# Altium schematic sheet Sallen_key_LPF.SchDoc
size A
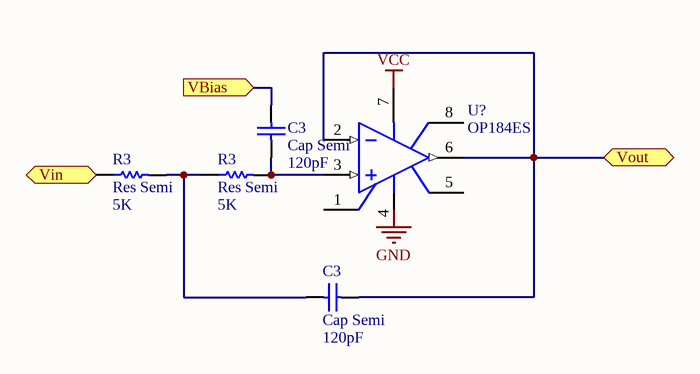
[diagram p0: Sallen_key_LPF.SchDoc]

## Parts
(Parts that share a designator on the sheet are numbered #1, #2 ... from top to bottom, then left to right.)
C3#1  Cap Semi  value 120pF  [CAPC3216L]
C3#2  Cap Semi  value 120pF  [CAPC3216L]
R3#1  Res Semi  value 5K  [RESC1005L]
R3#2  Res Semi  value 5K  [RESC1005L]
U?  OP184ES  [SO-8_N]

## Ports
VBias (in), Vin, Vout

## Nets
VCC: U?.7(V+)
VBias: C3#1.2 ; port VBias
Vin: R3#1.1 ; port Vin
Vout: C3#2.1 U?.2(IN-) U?.6(OUT) ; port Vout
NetC3#1_1: C3#1.1 R3#2.2 U?.3(IN+)
NetC3#2_2: C3#2.2 R3#1.2 R3#2.1

Not connected (* = marked no-connect by the designer): U? 1(NUL) 4(V-) 5(NUL) 8(NC)

## Notes on the sheet
- Labels drawn without touching a wire or pin: GND

## Library data of the parts
C3#1 C3#2 = Cap Semi: Capacitor (Semiconductor SIM Model); Published: 8-Jun-2000; LatestRevisionDate: 29-May-2009; LatestRevisionNote: IPC-7351 Footprint Added.; PackageReference: C1206; Publisher: Altium Limited; PackageDescription: Chip Capacitor
R3#1 R3#2 = Res Semi: Semiconductor Resistor; Published: 8-Jun-2000; LatestRevisionDate: 17-Jul-2002; LatestRevisionNote: Re-released for DXP Platform.; PackageReference: AXIAL-0.5; Publisher: Altium Limited
U? = OP184ES: Precision Rail-to-Rail Input and Ouput Operational Amplifier; Note: Pin 8 is not connected.; Published: 8-Jun-2000; LatestRevisionDate: 13-Apr-2006; LatestRevisionNote: IPC-7351 Footprint Added.; DatasheetVersion: REV. 0 1996; PackageVersion: revA; PackageReference: SO-8; Publisher: Altium Limited; PackageDescription: 8-Pin Small Outline Integrated Circuit 1.27 mm Pitch; Code_JEDEC: MS-012-AA; Code_IPC: SOIC127P600-8; ComponentLink1Description: Manufacturer Link; ComponentLink1URL: http://www.analog.com/en/prod/0,,759_786_OP184%2C00.html; ComponentLink2Description: Datasheet; ComponentLink2URL: http://www.analog.com/UploadedFiles/Data_Sheets/390492658OP184_284_484_b.pdf